# EAGLE design usbif3 (EAGLE 6.5.0)
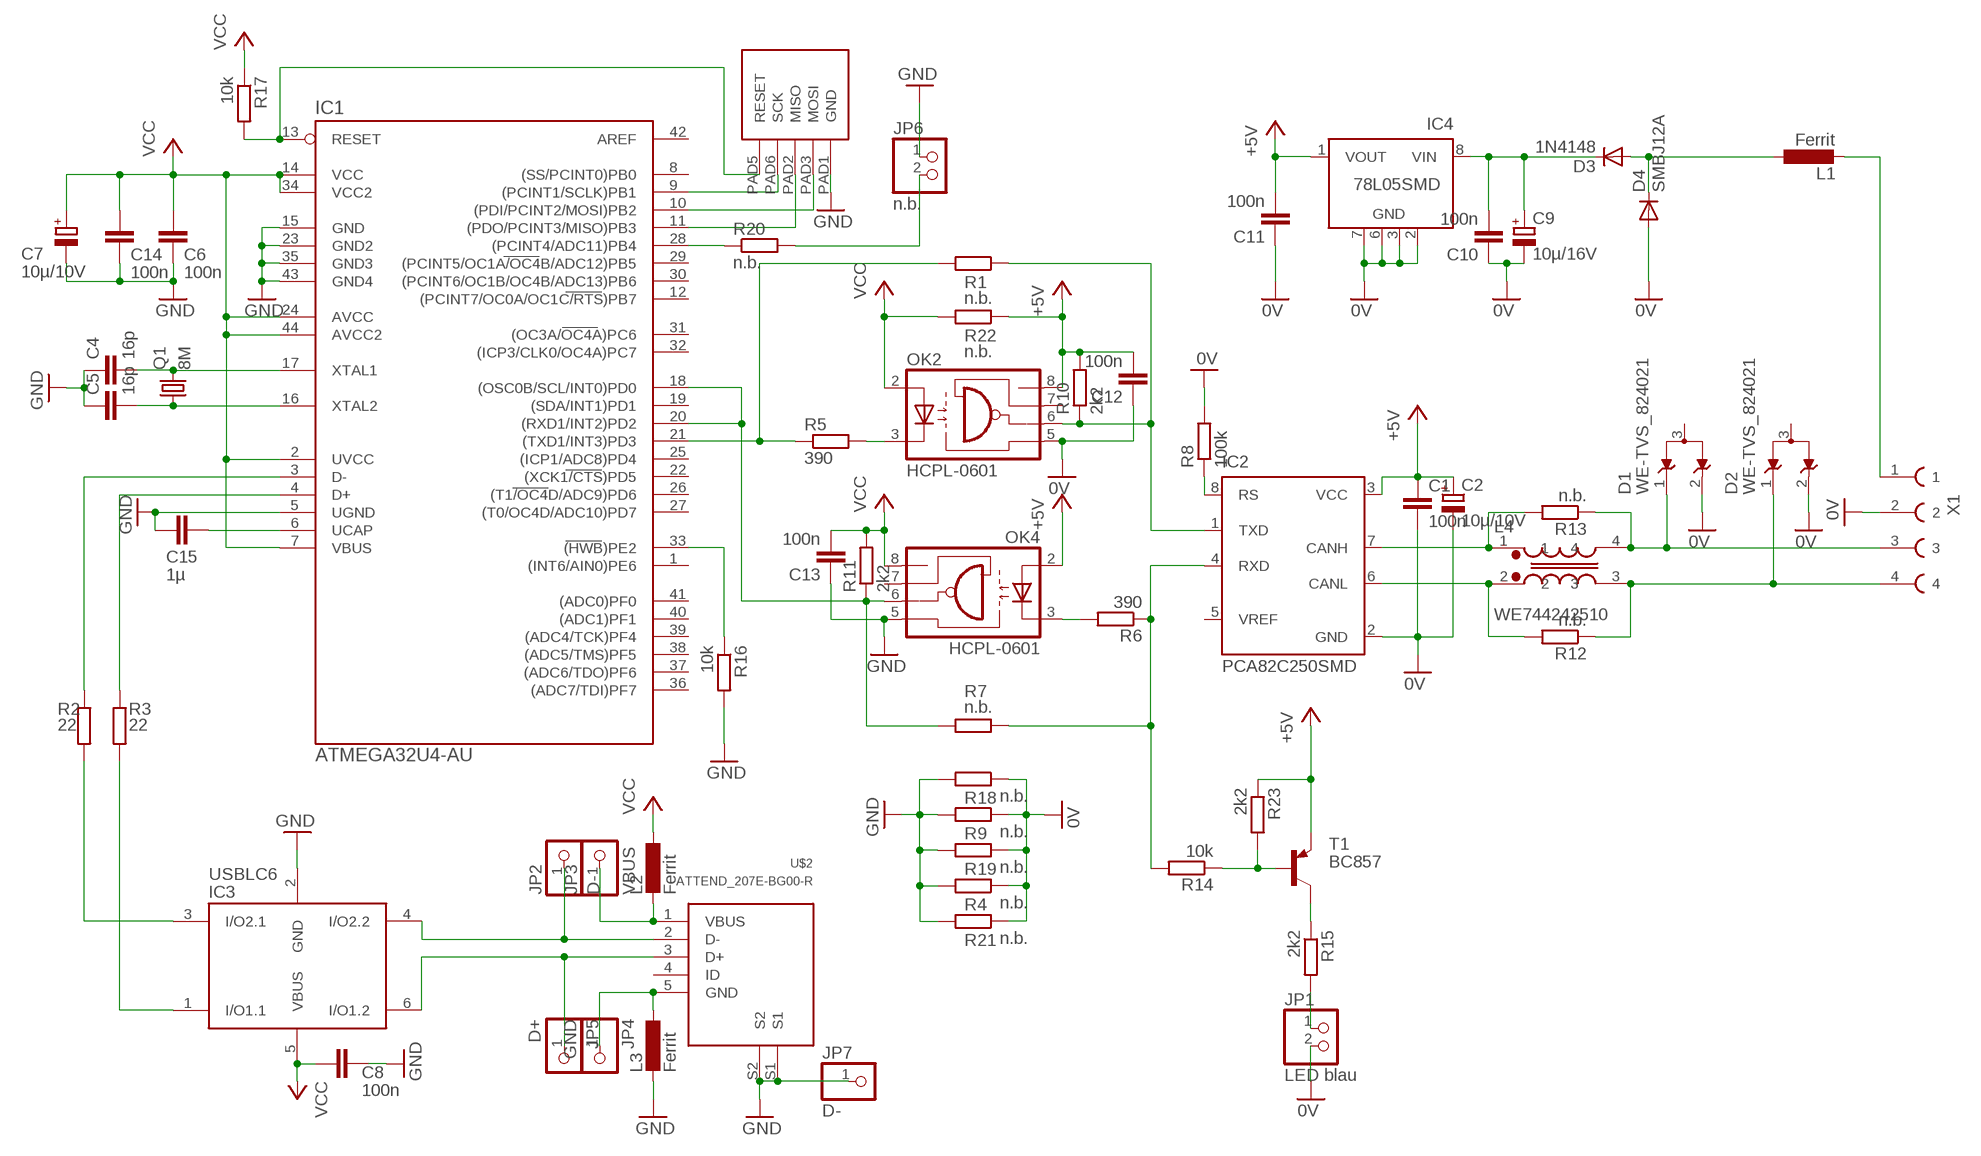
[diagram p0: schematic, sheet 1]

## Parts
C1  100n  C-EUC0603  [C0603]
C2  10µ/10V  CPOL-EUA/3216-18W  [A/3216-18W]
C4  16p  C-EUC0603  [C0603]
C5  16p  C-EUC0603  [C0603]
C6  100n  C-EUC0603  [C0603]
C7  10µ/10V  CPOL-EUA/3216-18W  [A/3216-18W]
C8  100n  C-EUC0603  [C0603]
C9  10µ/16V  CPOL-EUA/3216-18W  [A/3216-18W]
C10  100n  C-EUC0603  [C0603]
C11  100n  C-EUC0603  [C0603]
C12  100n  C-EUC0603  [C0603]
C13  100n  C-EUC0603  [C0603]
C14  100n  C-EUC0603  [C0603]
C15  1µ  C-EUC1210K  [C1210K]
D1  WE-TVS_824021  [WE-TVS_SOT23-3L]
D2  WE-TVS_824021  [WE-TVS_SOT23-3L]
D3  1N4148  DIODE-SOD80C  [SOD80C]
D4  SMBJ12A  DIODE-SMB  [SMB]
IC1  ATMEGA32U4-AU  [TQFP44]
IC2  PCA82C250SMD  [SO8]
IC3  USBLC6  [SOT23-6L]
IC4  78L05SMD  [SO08]
JP1  LED blau  PINHD-1X2  [1X02]
JP2  D-  PINHD-1X1  [1X01]
JP3  VBUS  PINHD-1X1  [1X01]
JP4  GND  PINHD-1X1  [1X01]
JP5  D+  PINHD-1X1  [1X01]
JP6  n.b.  PINHD-1X2  [1X02]
JP7  D-  PINHD-1X1  [1X01]
L1  Ferrit  L-EUL1806  [L1806]
L2  Ferrit  L-EUL1806  [L1806]
L3  Ferrit  L-EUL1806  [L1806]
L4  WE744242510  WE-SLM  [WE-SLM]
OK2  HCPL-0601  HCPL0601  [SOIC08]
OK4  HCPL-0601  HCPL0601  [SOIC08]
Q1  8M  CRYSTALSM49  [SM49]
R1  n.b.  R-EU_MELF0204R  [MINI_MELF-0204R]
R2  22  R-EU_R0603  [R0603]
R3  22  R-EU_R0603  [R0603]
R4  n.b.  R-EU_MELF0204R  [MINI_MELF-0204R]
R5  390  R-EU_R0603  [R0603]
R6  390  R-EU_R0603  [R0603]
R7  n.b.  R-EU_MELF0204R  [MINI_MELF-0204R]
R8  100k  R-EU_R0603  [R0603]
R9  n.b.  R-EU_MELF0204R  [MINI_MELF-0204R]
R10  2k2  R-EU_R0603  [R0603]
R11  2k2  R-EU_R0603  [R0603]
R12  n.b.  R-EU_R0603  [R0603]
R13  n.b.  R-EU_R0603  [R0603]
R14  10k  R-EU_R0603  [R0603]
R15  2k2  R-EU_R0603  [R0603]
R16  10k  R-EU_R0603  [R0603]
R17  10k  R-EU_R0603  [R0603]
R18  n.b.  R-EU_MELF0204R  [MINI_MELF-0204R]
R19  n.b.  R-EU_MELF0204R  [MINI_MELF-0204R]
R20  n.b.  R-EU_R0603  [R0603]
R21  n.b.  R-EU_MELF0204R  [MINI_MELF-0204R]
R22  n.b.  R-EU_MELF0204R  [MINI_MELF-0204R]
R23  2k2  R-EU_R0603  [R0603]
T1  BC857  BC807  [SOT323-BEC]
U$1  ATMEL_ISP  [ATMEL_ISP]
U$2  ATTEND_207E-BG00-R  [ATTEND_207E-BG00-R]
X1  DEGSON_15EDGRC-3.5_4  [DEGSON_15EDGRC-3.5_4]

## Nets
0V: C1.2 C2.- C9.- C10.1 C11.1 C12.1 D1.2 D2.2 D4.A IC2.2(GND) IC4.2(GND) IC4.3(GND) IC4.6(GND) IC4.7(GND) JP1.2 OK2.5(GND) R4.1 R8.2 R9.1 R18.1 R19.1 R21.1 X1.2
#RESET: IC1.13(RESET) R17.2 U$1.PAD5(RESET)
+5V: C1.1 C2.+ C11.2 C12.2 IC2.3(VCC) IC4.1(VOUT) OK2.8(VCC) OK4.2(A) R10.2 R22.1 R23.1 T1.E
+12V: L1.2 X1.1
B+: D1.1 L4.4 R13.1 X1.3
B-: D2.1 L4.3 R12.1 X1.4
D+: IC3.6(I/O1.2) JP5.1 U$2.3(D+)
D-: IC3.4(I/O2.2) JP2.1 U$2.2(D-)
GND: C4.1 C5.1 C6.1 C7.- C8.1 C13.1 C14.1 C15.2 IC1.5(UGND) IC1.15(GND) IC1.23(GND2) IC1.35(GND3) IC1.43(GND4) IC3.2(GND) JP6.1 JP7.1 L3.2 OK4.5(GND) R4.2 R9.2 R16.2 R18.2 R19.2 R21.2 U$1.PAD1(GND) U$2.S1 U$2.S2
N$1: OK2.3(C) R5.2
N$2: IC1.18((OSC0B/SCL/INT0)PD0) IC1.20((RXD1/INT2)PD2) OK4.6(VO) R7.2 R11.1
N$3: IC2.1(TXD) OK2.6(VO) R1.1 R10.1
N$4: IC2.4(RXD) R6.1 R7.1 R14.2
N$5: IC1.10((PDI/PCINT2/MOSI)PB2) U$1.PAD3(MOSI)
N$6: IC1.11((PDO/PCINT3/MISO)PB3) U$1.PAD2(MISO)
N$7: IC1.9((PCINT1/SCLK)PB1) U$1.PAD6(SCK)
N$9: IC1.4(D+) R3.1
N$10: IC2.7(CANH) L4.1 R13.2
N$11: C15.1 IC1.6(UCAP)
N$12: IC1.3(D-) R2.1
N$13: IC3.1(I/O1.1) R3.2
N$14: IC3.3(I/O2.1) R2.2
N$15: C4.2 IC1.17(XTAL1) Q1.2
N$16: C5.2 IC1.16(XTAL2) Q1.1
N$17: IC2.6(CANL) L4.2 R12.2
N$18: JP6.2 R20.2
N$19: IC1.28((PCINT4/ADC11)PB4) R20.1
N$20: D3.A D4.C L1.1
N$21: C9.+ C10.2 D3.C IC4.8(VIN)
N$22: OK4.3(C) R6.2
N$23: R15.1 T1.C
N$24: IC1.33((HWB)PE2) R16.1
N$25: R14.1 R23.2 T1.B
N$26: JP1.1 R15.2
N$27: IC2.8(RS) R8.1
N$29: JP4.1 L3.1 U$2.5(GND)
N$30: IC1.21((TXD1/INT3)PD3) R1.2 R5.1
VBUS: JP3.1 L2.2 U$2.1(VBUS)
VCC: C6.2 C7.+ C8.2 C13.2 C14.2 IC1.2(UVCC) IC1.7(VBUS) IC1.14(VCC) IC1.24(AVCC) IC1.34(VCC2) IC1.44(AVCC2) IC3.5(VBUS) L2.1 OK2.2(A) OK4.8(VCC) R11.2 R17.1 R22.2
Unconnected: D1.3(GND) D2.3(GND) IC1.1((INT6/AIN0)PE6) IC1.8((SS/PCINT0)PB0) IC1.12((PCINT7/OC0A/OC1C/RTS)PB7) IC1.19((SDA/INT1)PD1) IC1.22((XCK1/CTS)PD5) IC1.25((ICP1/ADC8)PD4) IC1.26((T1/OC4D/ADC9)PD6) IC1.27((T0/OC4D/ADC10)PD7) IC1.29((PCINT5/OC1A/OC4B/ADC12)PB5) IC1.30((PCINT6/OC1B/OC4B/ADC13)PB6) IC1.31((OC3A/OC4A)PC6) IC1.32((ICP3/CLK0/OC4A)PC7) IC1.36((ADC7/TDI)PF7) IC1.37((ADC6/TDO)PF6) IC1.38((ADC5/TMS)PF5) IC1.39((ADC4/TCK)PF4) IC1.40((ADC1)PF1) IC1.41((ADC0)PF0) IC1.42(AREF) IC2.5(VREF) IC4.4(NC) IC4.5(NC) OK2.7(VE) OK4.7(VE) U$2.4(ID)

## Library data of the parts
C1 C4-C6 C8 C10-C15 = resistor:C-EU: CAPACITOR, European symbol
C2 C7 C9 = rcl:CPOL-EU: POLARIZED CAPACITOR, European symbol
D1 D2 = EagleLibrary_Wuerth_Elektronik_eiSos_V6_20140807:WE-TVS_824021: TVS Diode Array WE-TVS, Standard Series - Low capazity - No leakage current - Low clamping voltage - high ESD voltage protection - Uni- and bidirectional protection -- DC Distribution -- Headsets and Accessoires -- PDAs -- Digital Cameras -- MP3-Players -- Touch Panels <http://katalog.we-online.de/media/images/eisos/VarTVS_highspeed_pf2.jpg.jpg> Details see: http://katalog.we-online.de/en/pbs/WE-TVS_High_Speed? Updated by Dan Xu 2014-07-11 2014 (C) Würth Elektronik
D3 D4 = diode:DIODE-: DIODE
IC1 = mega32U4:ATMEGA32U4-AU: ATMega32U4-AU Library by: http://projects.weber-itam.de
IC2 = mylib:PCA82C250: CAN CONTROLLER INTERFACE
IC3 = mylib:USBLC6
IC4 = linear:78L*SMD: Positive VOLTAGE REGULATOR
JP1 JP6 = pinhead:PINHD-1X2: PIN HEADER
JP2-JP5 JP7 = pinhead:PINHD-1X1: PIN HEADER
L1-L3 = mylib:L-EU: INDUCTOR, European symbol
L4 = EagleLibrary_Wuerth_Elektronik_eiSos_V6_20140807:WE-SLM: SMD Common Mode Line Filter WE-SLM - Small size - Low Profile - High Impedance - High current capability up to 300 mA -- USB -- CAN -- Firewire -- Data Lines -- Power supply systems -- Signal Lines <http://katalog.we-online.de/media/images/eisos/IndSLM_pf2.jpg> Details see: http://katalog.we-online.de/en/pbs/WE-SLM?? Updated by Dan Xu 2014-07-11 2014 (C) Würth Elektronik
OK2 OK4 = optocoupler:HCPL0601: HEWLETT PACKARD OPTO COUPLER; MF: AGILENT TECHNOLOGIES; MPN: HCPL-0601-000E; OC_FARNELL: 9995102; OC_NEWARK: 88H7776
Q1 = crystal:CRYSTAL: CRYSTAL; OC_FARNELL: unknown; OC_NEWARK: unknown
R1-R23 = resistor:R-EU_: RESISTOR, European symbol
T1 = mylib:BC807
U$1 = mylib:ATMEL_ISP
U$2 = mylib:ATTEND_207E-BG00-R
X1 = mylib:DEGSON_15EDGRC-3.5_4

## Net classes
0 default: clearance 0.205 mm

## Board
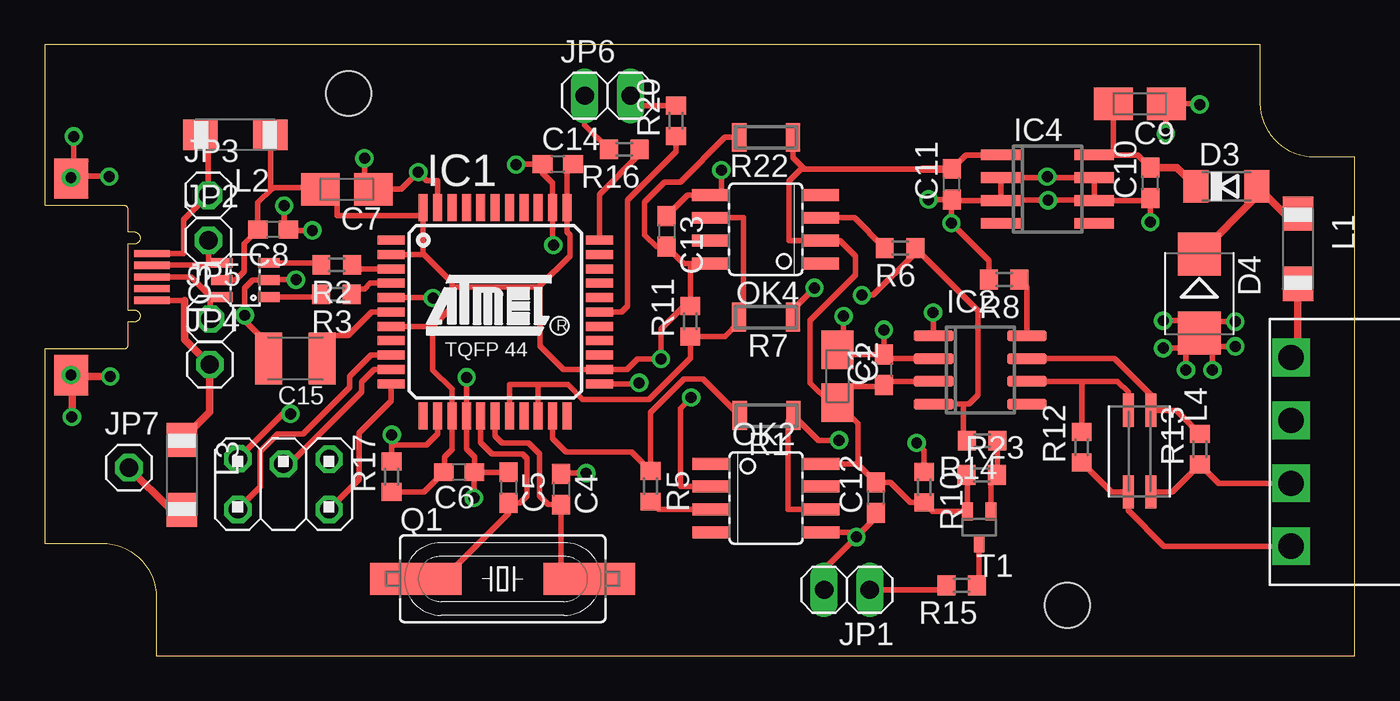
[diagram p1: board, top side]
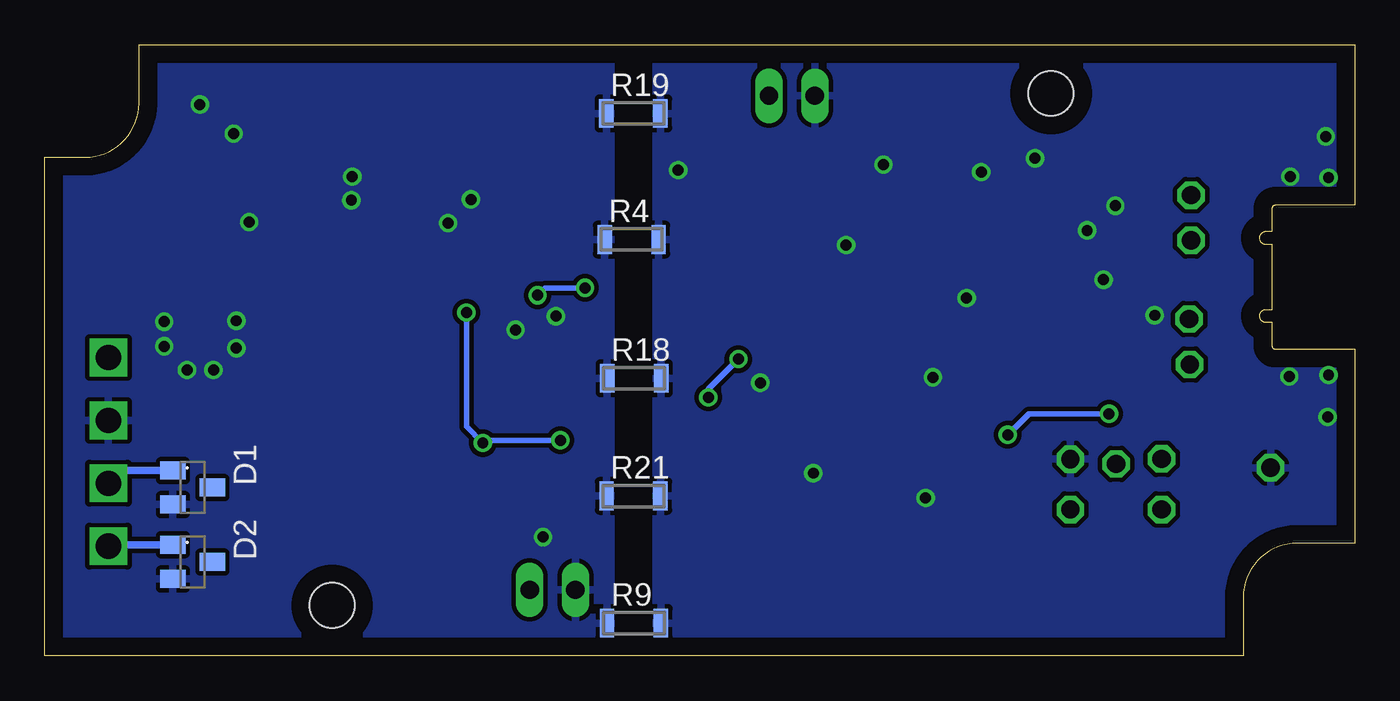
[diagram p2: board, bottom side, seen from below]

Size 72.88 x 34 mm. Coordinates in mm from the lower left corner, seen from the top.
Outline: 0,34 0,25.07 4.42,25.07 arc-90 4.6,24.89 4.6,23.6 4.95,23.6 arc-176 4.98,22.91 4.6,22.91 4.6,19.25 4.95,19.25 arc-180 4.95,18.57 4.6,18.57 4.6,17.25 arc-90 4.42,17.07 0,17.07 0,6.25 3.2,6.25 arc-90 6.2,3.25 6.2,0 72.88,0 72.88,27.75 70.65,27.75 arc-90 67.65,30.75 67.65,34 0,34
Copper layers (1*16): Top 0.035mm / dielectric 1.5mm / Bottom 0.035mm
Design rules "Bilex DRU": minimum track width 10mil, minimum drill 24mil, track to track 10mil, track to pad 10mil, pad to pad 10mil, via to via 10mil, smd to smd 10mil, copper to edge 40mil, drill to drill 8mil, minimum pad ring 10mil, minimum via ring 8mil, stop-mask expansion 4mil, vias tented up to drill 0mil, thermal gap 10mil
Holes 2.5 mm at 56.9,2.8 16.9,31.3

### Footprints (pad centres in the part's own frame; a part is rotated, then mirrored left to right if it is on the bottom)
C0603 = smd 1.1 x 1: 1 -0.85,0; 2 0.85,0
A/3216-18W = smd 2.15 x 1.8: + 1.475,0; - -1.475,0
C1210K = smd 1.5 x 2.9: 1 -1.5,0; 2 1.5,0
WE-TVS_SOT23-3L = smd 1 x 1.4: 1 -0.95,-1.1; 2 0.95,-1.1; 3 0,1.1
SOD80C = smd 1.4 x 1.8: A 1.7,0; C -1.7,0
SMB = smd 2.4 x 2.4: A 2.2,0; C -2.2,0
TQFP44 = smd 1.5 x 0.5: 1 -5.8,4; 2 -5.8,3.2; 3 -5.8,2.4; 4 -5.8,1.6; 5 -5.8,0.8; 6 -5.8,0; 7 -5.8,-0.8; 8 -5.8,-1.6; 9 -5.8,-2.4; 10 -5.8,-3.2; 11 -5.8,-4; 23 5.8,-4; 24 5.8,-3.2; 25 5.8,-2.4; 26 5.8,-1.6; 27 5.8,-0.8; 28 5.8,0; 29 5.8,0.8; 30 5.8,1.6; 31 5.8,2.4; 32 5.8,3.2; 33 5.8,4 | smd 0.5 x 1.5: 12 -4,-5.8; 13 -3.2,-5.8; 14 -2.4,-5.8; 15 -1.6,-5.8; 16 -0.8,-5.8; 17 0,-5.8; 18 0.8,-5.8; 19 1.6,-5.8; 20 2.4,-5.8; 21 3.2,-5.8; 22 4,-5.8; 34 4,5.8; 35 3.2,5.8; 36 2.4,5.8; 37 1.6,5.8; 38 0.8,5.8; 39 0,5.8; 40 -0.8,5.8; 41 -1.6,5.8; 42 -2.4,5.8; 43 -3.2,5.8; 44 -4,5.8
SO8 = smd 0.6 x 2.2: 1 -1.905,-2.6; 2 -0.635,-2.6; 3 0.635,-2.6; 4 1.905,-2.6; 5 1.905,2.6; 6 0.635,2.6; 7 -0.635,2.6; 8 -1.905,2.6
SOT23-6L = smd 0.55 x 1.2: 1 -0.95,-1.3; 2 0,-1.3; 3 0.95,-1.3; 4 0.95,1.3; 5 0,1.3; 6 -0.95,1.3
SO08 = smd 0.6 x 2.2: 1 -1.905,-2.6; 2 -0.635,-2.6; 3 0.635,-2.6; 4 1.905,-2.6; 5 1.905,2.6; 6 0.635,2.6; 7 -0.635,2.6; 8 -1.905,2.6
1X02 = drill 1.016 long: 1 -1.27,0; 2 1.27,0
1X01 = drill 1.016 octagon: 1 0,0
L1806 = smd 1.9 x 1.7: 1 -0.68,0; 2 3.22,0
WE-SLM = smd 1.85 x 0.6: 1 -2.28,0.63; 2 -2.28,-0.62; 3 2.27,-0.62; 4 2.27,0.63
SOIC08 = smd 0.66 x 2.032: 1 -1.905,-3.073; 2 -0.635,-3.073; 3 0.635,-3.073; 4 1.905,-3.073; 5 1.905,3.073; 6 0.635,3.073; 7 -0.635,3.073; 8 -1.905,3.073
SM49 = smd 5.08 x 1.778: 1 -4.826,0; 2 4.826,0
MINI_MELF-0204R = smd 0.8 x 1.6: 1 -1.5,0; 2 1.5,0
R0603 = smd 1 x 1.1: 1 -0.85,0; 2 0.85,0
SOT323-BEC = smd 0.6 x 1: B -0.65,-0.9; C 0,0.9; E 0.65,-0.9
ATMEL_ISP = drill 1.016 octagon: PAD1 1.397,-2.54; PAD2 -1.41,-2.54; PAD3 1.13,0; PAD5 1.41,2.54; PAD6 -1.41,2.54
ATTEND_207E-BG00-R = smd 0.4 x 2: 1 -1.3,3.95; 2 -0.65,3.95; 3 0,3.95; 4 0.65,3.95; 5 1.3,3.95 | smd 2.25 x 1.9: S1 -5.475,-0.55; S2 5.475,-0.55
DEGSON_15EDGRC-3.5_4 = drill 1.4 square: 1 2.15,1.2; 2 5.65,1.2; 3 9.15,1.2; 4 12.65,1.2

### Placement (x,y rotation side)
C1  46.7,15.92 90 top
C2  44.11,15.56 270 top
C4  28.74,9.26 270 top
C5  25.8,9.36 270 top
C6  23.05,10.21 180 top
C7  16.81,25.96 180 top
C8  12.7,23.72 180 top
C9  60.93,30.72 180 top
C10  61.52,26.32 90 top
C11  50.46,26.24 90 top
C12  46.26,8.8 90 top
C13  34.59,23.62 270 top
C14  28.54,27.37 0 top
C15  13.94,16.54 180 top
D1  64.66,9.36 270 bottom
D2  64.66,5.22 270 bottom
D3  65.75,26.13 0 top
D4  64.24,20.16 270 top
IC1  25.05,19.13 0 top
IC2  52.05,15.9 270 top
IC3  11.15,20.92 90 top
IC4  55.8,25.97 270 top
JP1  44.63,3.67 180 top
JP2  9.1,23.12 0 top
JP3  9.09,25.63 0 top
JP4  9.17,16.21 0 top
JP5  9.2,18.74 0 top
JP6  31.31,31.17 0 top
JP7  4.67,10.46 0 top
L1  69.73,23.92 270 top
L2  11.87,28.99 180 top
L3  7.62,11.33 270 top
L4  60.91,11.38 270 top
OK2  40.13,8.78 270 top
OK4  40.11,23.74 90 top
Q1  25.47,4.28 0 top
R1  40.16,13.37 180 top
R2  16.24,21.76 180 top
R3  16.23,20.11 180 top
R4  40.23,23.16 0 bottom
R5  33.71,9.42 270 top
R6  47.58,22.69 180 top
R7  40.13,18.85 180 top
R8  53.38,20.94 180 top
R9  40.1,1.81 0 bottom
R10  48.93,9.37 270 top
R11  35.92,18.62 90 top
R12  57.7,11.62 90 top
R13  64.27,11.49 90 top
R14  52.15,11.97 180 top
R15  51.02,3.91 180 top
R16  32.24,28.19 180 top
R17  19.29,9.97 90 top
R18  40.09,15.44 0 bottom
R19  40.13,30.18 0 bottom
R20  35.12,29.78 90 top
R21  40.13,8.89 0 bottom
R22  40.13,28.85 180 top
R23  52.12,10.06 0 top
T1  51.99,7.14 180 top
U$1  13.27,9.55 90 top
U$2  2.01,21.08 270 top
X1  68.15,18.75 270 top

### Tracks (layer width: path | path; a pad name or v marks a point on that pad's centre or on a via)
0V  (via drill 0.61)
  Top 0.305: IC4.6 61.38,25.33 | IC4.6 IC4.7 IC4.2 IC4.3 50.52,25.33 | IC2.2 46.93,16.54 | v46.69,18.14 C1.2 44.37,16.77 C2.- 44.45,17.38 v44.45,18.9 | IC4.6 58.4,25.35 58.37,25.35 | 53.19,25.4 53.24,25.35 v55.83,25.35 58.32,25.35 58.37,25.4 | v62.23,18.64 64.24,18.64 D4.A | v62.23,17.12 64.31,17.12 64.31,17.22 | v66.24,18.59 64.26,18.59 64.26,17.88 | v66.24,17.22 64.31,17.22 | 64.31,17.22 64.31,17.93 | v64.97,15.9 64.97,17.93 64.31,17.93 | v63.5,15.9 63.5,17.93 64.31,17.93 | 62.38,30.7 v62.38,29.06 | v64.26,30.68 64.26,30.72 C9.- | C10.1 61.52,24.23 v61.52,24.13 | C11.1 50.44,25.4 | 50.44,25.4 v49.17,25.4 | 50.44,25.4 v50.44,24.08 52.53,22 R8.2 | OK2.5 44.89,6.87 v45.16,6.6 | C12.1 46.26,7.7 v45.16,6.6 | v45.16,6.6 43.36,4.8 JP1.2
  Top 0.406: 50.52,25.33 C11.1 | 58.37,25.33 58.37,25.35 | 46.93,16.54 C1.2
  other vias: 55.78,26.67
  pour Bottom: 41.38,33.8 72.71,33.8 72.66,0.2 41.38,0.2
#RESET  (via drill 0.61)
  Top 0.305: U$1.PAD5 13.24,13.46 v13.66,13.46 | v19.3,12.29 19.3,11.58 | 19.3,11.58 19.3,10.84 R17.2 | IC1.13 21.86,12.36 21.23,11.73 19.46,11.73 19.3,11.58
  Bottom 0.305: v13.66,13.46 18.14,13.46 v19.3,12.29
+5V
  Top 0.305: IC4.1 51.24,27.87 C11.2 | IC2.3 46.9,15.27 | OK2.8 45.23,10.68 45.25,10.66 | 45.25,10.66 C12.2 47.04,9.65 48.17,8.52 R10.2 49.4,8.04 T1.E 51.34,10.06 R23.1 | C2.+ 44.1,14.49 44.6,14.99 46.33,14.99 46.41,15.07 C1.1 | C2.+ 45.25,12.94 45.25,10.66 | C2.+ 43.68,14.08 42.57,15.19 42.57,18.64 45.11,21.18 45.11,22.25 44.26,23.1 OK4.2 41.4,23.1 41.4,26.42 42.08,27.09 42.27,27.09 | 48.84,27.09 42.27,27.09 | R22.1 41.63,27.73 42.27,27.09
  Top 0.406: C11.2 48.84,27.09 | 46.9,15.27 C1.1
+12V
  Top 0.406: X1.1 69.72,16.97 L1.2
B+
  Top 0.305: L4.4 62.74,9.11 R13.1 65.32,9.6 X1.3
  Bottom 0.406: D1.1 68.64,10.31 X1.3
B-
  Top 0.305: X1.4 62.28,6.1 60.29,8.09 L4.3 59.35,9.11 R12.1
  Bottom 0.406: D2.1 69.28,6.17 X1.4
D+
  Top 0.305: JP5.1 9.2,19.97 IC3.6 9.24,19.97 8.13,21.08 U$2.3
D-
  Top 0.305: 9.35,21.89 9.83,21.89 IC3.4 9.85,21.73 9.1,21.73 | JP2.1 9.1,21.73 | U$2.2 9.1,21.73
GND  (via drill 0.6, 0.61)
  Top 0.305: v23.88,8.79 23.88,10.21 | C4.1 28.74,10.16 v30.12,10.16 | 23.88,10.21 C6.1 23.9,11.05 23.45,11.49 IC1.15 23.45,15.48 v23.47,15.49 | 23.88,10.21 C5.1 | IC3.2 11.57,20.92 11.12,20.47 v11.12,18.95 11.12,18.64 12.44,17.33 C15.2 | IC1.43 21.86,26.46 21.25,26.46 v20.78,26.92 19.82,25.96 C7.- 18.19,26.52 | v26.21,27.33 26.25,27.36 C14.1 27.69,26.87 28.25,26.3 IC1.35 28.25,22.9 v28.3,22.86 | IC1.5 21.57,19.93 v21.59,19.91 | IC1.23 33.02,15.13 v33.07,15.19 | v13.97,20.93 12.5,20.93 | R16.2 30.04,29.53 JP6.1 | C13.1 35.77,25.64 OK4.5 37.64,25.64 v37.64,27.03 | 17.58,25.91 17.78,26.11 v17.78,27.69 | C8.1 13.31,23.96 v13.31,25.04 | v14.88,23.67 13.56,23.67 13.56,23.72 | v1.6,28.91 1.6,26.7 | 1.6,26.7 U$2.S1 | 1.6,26.7 3.55,26.7 v3.58,26.67
  Top 0.406: L3.2 7.03,8.11 JP7.1 | v3.63,15.54 1.52,15.54 | U$2.S2 1.52,15.54 | 1.52,15.54 1.52,13.26 1.5,13.26 v1.5,13.28
  other vias: 1.45,26.62 1.45,15.62
  pour Bottom: 2.12,33.81 38.88,33.81 38.88,0.19 0.21,0.19 0.19,33.81
N$1
  Top 0.305: OK2.3 34.14,8.14 R5.2
N$2
  Top 0.305: IC1.18 25.86,15.09 27.45,15.09 | 27.45,15.09 IC1.20 | 27.45,15.09 29.11,15.09 29.92,14.28 33.63,14.28 35.92,16.56 R11.1 37.83,17.77 38.63,18.56 R7.2 38.86,18.85 38.86,24.37 OK4.6
N$3  (via drill 0.61)
  Top 0.305: OK2.6 41.35,8.14 41.35,13.06 R1.1 43.03,11.99 v44.2,11.99 | IC2.1 49.45,19.07 v49.43,19.1 | R10.1 48.93,11.42 v48.51,11.84
  Bottom 0.305: v49.43,19.1 49.43,12.75 v48.51,11.84 48.36,11.99 v44.2,11.99
N$4  (via drill 0.61)
  Top 0.305: IC2.4 51.1,14 | 51.1,14 51.41,14 51.92,14.51 51.92,19.21 R6.1 48.43,22.42 46.08,20.07 v45.47,20.07 | R7.1 41.63,19.27 v42.82,20.47 | R14.2 51.1,11.97 51.1,14
  Bottom 0.305: v42.82,20.47 45.06,20.47 v45.47,20.07
N$5
  Top 0.305: U$1.PAD3 13.62,10.68 17.63,14.68 17.63,15.24 18.32,15.94 IC1.10
N$6
  Top 0.305: IC1.11 19.25,14.18 17.48,12.39 17.48,9.8 U$1.PAD2
N$7
  Top 0.305: U$1.PAD6 11.99,9.39 11.99,11.38 12.95,12.34 14.38,12.34 16.97,14.94 16.97,15.54 18.16,16.73 IC1.9
N$9
  Top 0.305: IC1.4 18.09,20.73 17.78,20.42 17.39,20.42 R3.1
N$10
  Top 0.305: IC2.7 59.51,16.54 61.57,14.48 61.57,13.69 L4.1 62.95,13.66 R13.2
N$11
  Top 0.305: IC1.6 18.17,19.14 16.87,17.83 16.1,17.83 15.95,17.68 15.95,16.7 C15.1
N$12
  Top 0.305: IC1.3 17.31,21.54 R2.1
N$13
  Top 0.305: IC3.1 15.24,19.97 R3.2
N$14
  Top 0.305: IC3.3 15.28,21.87 R2.2
N$15
  Top 0.305: Q1.2 28.74,4.28 C4.2 28.01,8.41 27.53,8.89 27.53,11.23 26.92,11.84 25.45,11.84 25.05,12.23 IC1.17
N$16
  Top 0.305: IC1.16 24.25,11.86 24.89,11.23 26.57,11.23 26.82,10.97 26.82,8.89 26.44,8.51 C5.2 25.8,7.92 22.16,4.28 Q1.1
N$17
  Top 0.305: IC2.6 57.81,15.27 | 57.81,15.27 59.69,15.27 60.29,14.67 L4.2 | R12.2 57.7,15.15 57.81,15.27
N$18
  Top 0.305: R20.2 33.13,30.63 JP6.2
N$19
  Top 0.305: IC1.28 32.09,19.14 32.41,19.46 32.41,25.35 35.12,28.06 R20.1
N$20
  Top 0.406: L1.1 68.97,24.6 D3.A 67.45,25.57 D4.C
  Top 1.016: 63.64,22.36 D4.C
N$21
  Top 0.305: C10.2 60.82,27.87 IC4.8 59.45,27.87 C9.+
  Top 0.406: C10.2 63,27.17 D3.C
N$22
  Top 0.305: OK4.3 45.05,24.37 R6.2
N$23
  Top 0.305: T1.C 51.99,4.03 R15.1
N$24
  Top 0.305: IC1.33 30.86,25.67 33.09,27.91 R16.1
N$25
  Top 0.305: R14.1 53,10.06 R23.2 52.64,9.72 T1.B
N$26
  Top 0.305: JP1.1 49.92,3.67 R15.2
N$27
  Top 0.305: IC2.8 54.66,20.51 R8.1
N$29
  Top 0.305: U$2.5 7.79,19.78
  Top 0.406: L3.1 9.17,13.56 JP4.1 7.79,17.59 7.79,19.78
N$30
  Top 0.305: IC1.21 28.25,12.08 29.01,11.33 32.65,11.33 R5.1 33.71,13.54 35.56,15.39 36.63,15.39 R1.2
VBUS
  Top 0.305: L2.2 9.09,28.55 JP3.1 7.72,24.26 7.72,22.38 U$2.1
VCC  (via drill 0.61)
  Top 0.305: IC3.5 10.61,20.92 11.07,21.39 11.07,22.95 C8.2 11.85,25.21 12.62,25.98 | C14.2 29.05,27.03 IC1.34 29.05,23.57 29.21,23.42 29.21,22.25 27.56,20.6 | 22.66,20.52 22.66,20.78 21.1,22.34 IC1.2 21.05,22.34 IC1.44 21.05,24.49 16.26,24.49 16.26,25.5 15.33,25.5 C7.+ 15.23,26.06 12.7,26.06 12.62,25.98 | 22.66,20.52 22.66,19.41 21.59,18.34 | 21.59,18.34 IC1.7 | 21.59,18.34 21.59,15.9 22.66,14.84 IC1.14 22.66,11.48 22.25,11.07 22.25,10.27 C6.2 21.11,9.12 R17.1 | 27.56,20.6 27.48,20.52 22.66,20.52 | 27.56,20.6 27.56,17.25 28.87,15.94 IC1.24 32.39,15.94 32.97,16.51 v34.29,16.51 34.29,18.19 35.57,19.47 R11.2 35.92,21.83 | OK2.2 35.36,9.41 35.36,13.77 v35.97,14.38 | R22.2 37.85,28.85 35.36,26.36 34.49,26.36 33.38,25.25 33.38,23.42 34.02,22.77 C13.2 35.53,21.83 35.92,21.83 | 35.92,21.83 OK4.8 | L2.1 12.55,26.06 12.62,25.98
  Bottom 0.305: v34.29,16.51 35.97,14.83 v35.97,14.38